# EAGLE design ATSAMD09D14 Breakout rev B (EAGLE 6.6.0)
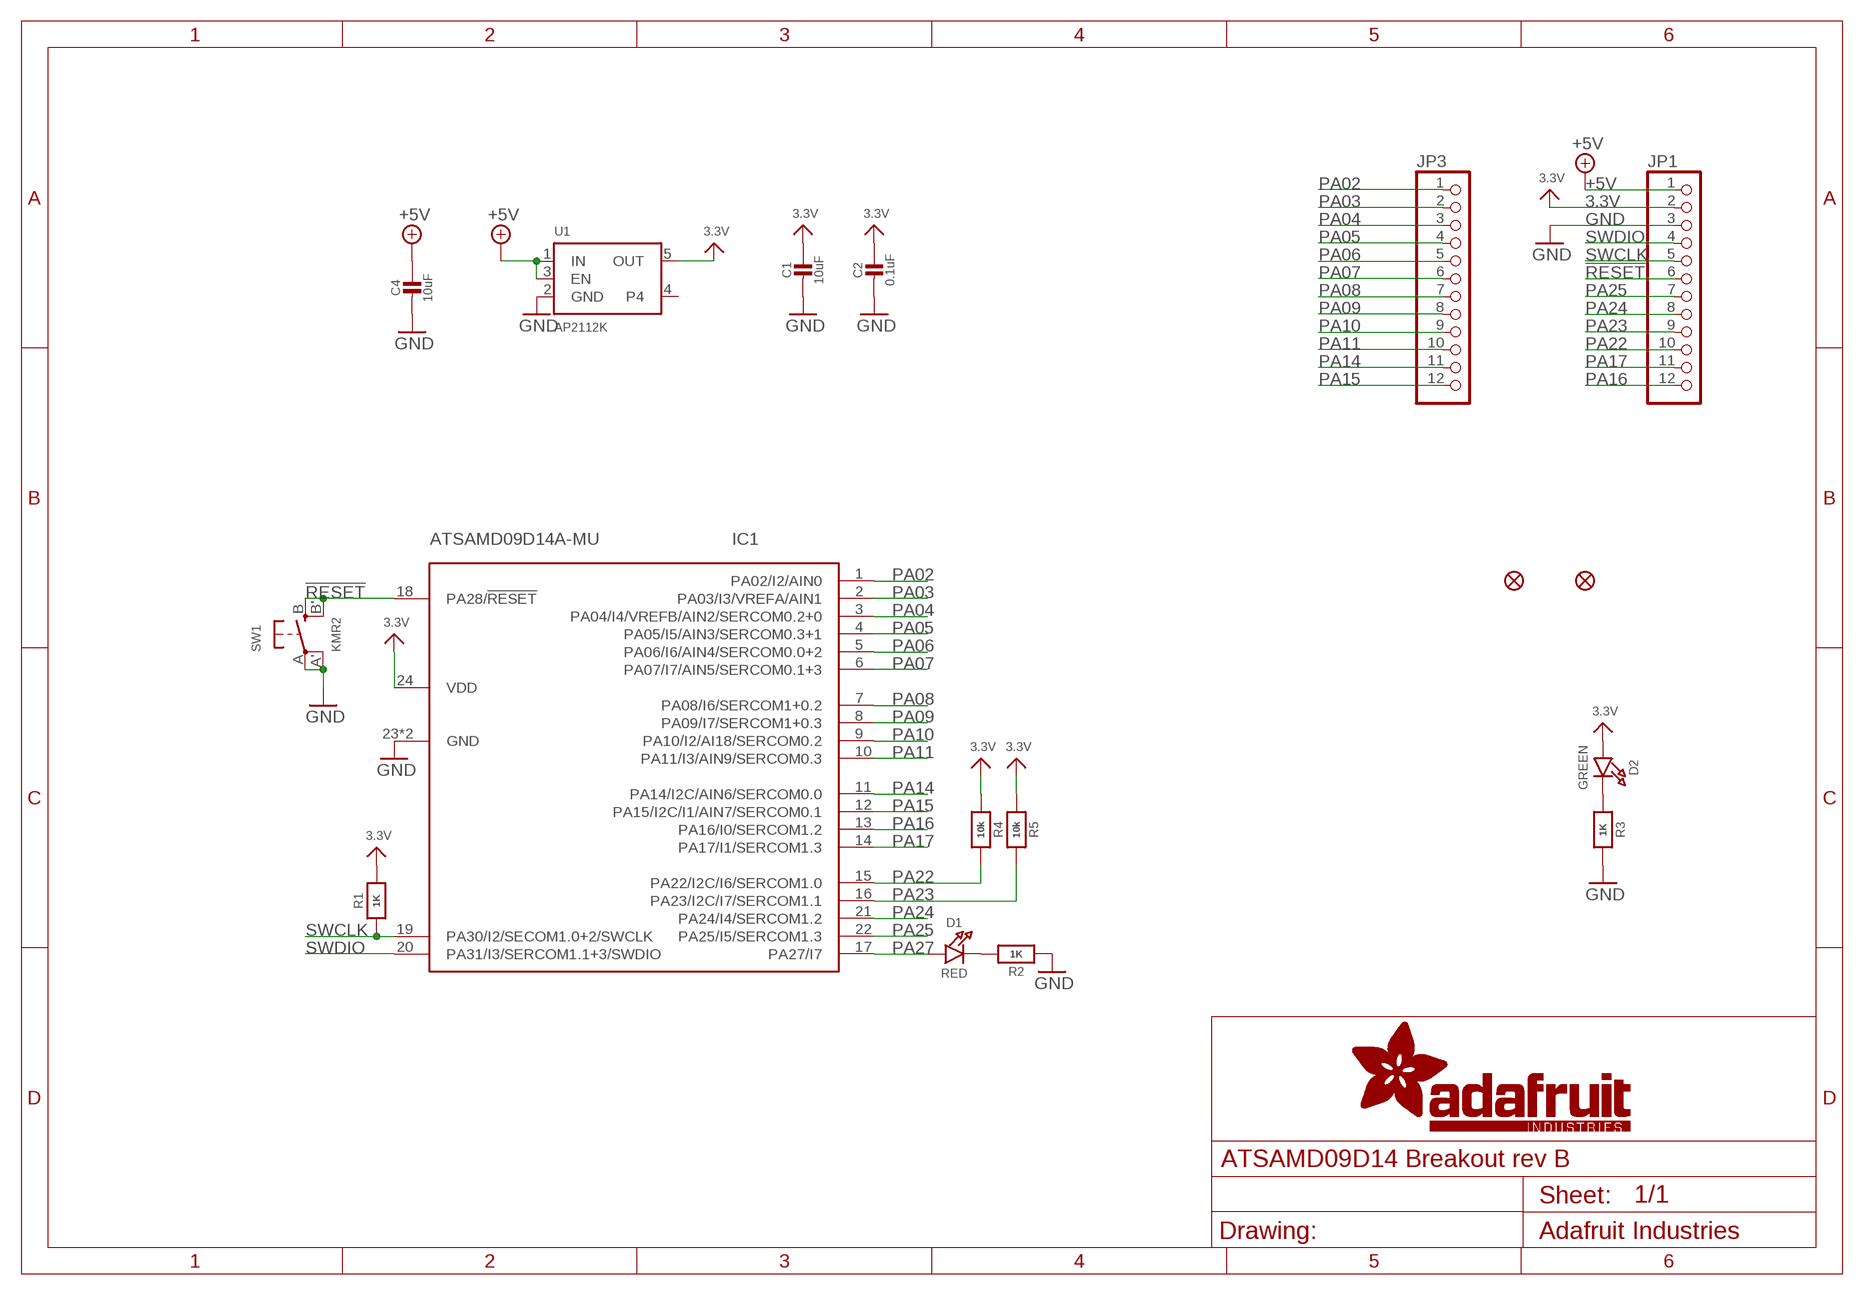
[diagram p0: schematic, sheet 1]

## Parts
C1  10uF  CAP_CERAMIC0805-NOOUTLINE  [0805-NO]
C2  0.1uF  CAP_CERAMIC0603_NO  [0603-NO]
C4  10uF  CAP_CERAMIC0805-NOOUTLINE  [0805-NO]
D1  RED  LED0805_NOOUTLINE  [CHIPLED_0805_NOOUTLINE]
D2  GREEN  LED0805_NOOUTLINE  [CHIPLED_0805_NOOUTLINE]
FID1  FIDUCIAL""  [FIDUCIAL_1MM]
FID2  FIDUCIAL""  [FIDUCIAL_1MM]
IC1  ATSAMD09D14A-MU  [QFN24_4MM]
JP1  HEADER-1X1276MIL  [1X12_ROUND_76MIL]
JP3  HEADER-1X1276MIL  [1X12_ROUND_76MIL]
R1  1K  RESISTOR_0603_NOOUT  [0603-NO]
R2  1K  RESISTOR_0603_NOOUT  [0603-NO]
R3  1K  RESISTOR_0603_NOOUT  [0603-NO]
R4  10k  RESISTOR_0603_NOOUT  [0603-NO]
R5  10k  RESISTOR_0603_NOOUT  [0603-NO]
SW1  KMR2  SWITCH_TACT_SMT4.6X2.8  [BTN_KMR2_4.6X2.8]
U1  AP2112K  VREG_SOT23-5  [SOT23-5]

## Nets
3.3V: C1.1 C2.1 D2.A IC1.24(VDD) JP1.2 R1.2 R4.1 R5.1 U1.5(OUT)
!RESET: IC1.18(PA28/!RESET) JP1.6 SW1.B'(S1) SW1.B(S)
+5V: C4.1 JP1.1 U1.1(IN) U1.3(EN)
GND: C1.2 C2.2 C4.2 IC1.23(GND) IC1.THERM(GND) JP1.3 R2.1 R3.2 SW1.A'(P1) SW1.A(P) U1.2(GND)
N$2: D1.C R2.2
N$3: D2.C R3.1
PA02: IC1.1(PA02/I2/AIN0) JP3.1
PA03: IC1.2(PA03/I3/VREFA/AIN1) JP3.2
PA04: IC1.3(PA04/I4/VREFB/AIN2/SERCOM0.2+0) JP3.3
PA05: IC1.4(PA05/I5/AIN3/SERCOM0.3+1) JP3.4
PA06: IC1.5(PA06/I6/AIN4/SERCOM0.0+2) JP3.5
PA07: IC1.6(PA07/I7/AIN5/SERCOM0.1+3) JP3.6
PA08: IC1.7(PA08/I6/SERCOM1+0.2) JP3.7
PA09: IC1.8(PA09/I7/SERCOM1+0.3) JP3.8
PA10: IC1.9(PA10/I2/AI18/SERCOM0.2) JP3.9
PA11: IC1.10(PA11/I3/AIN9/SERCOM0.3) JP3.10
PA14: IC1.11(PA14/I2C/AIN6/SERCOM0.0) JP3.11
PA15: IC1.12(PA15/I2C/I1/AIN7/SERCOM0.1) JP3.12
PA16: IC1.13(PA16/I0/SERCOM1.2) JP1.12
PA17: IC1.14(PA17/I1/SERCOM1.3) JP1.11
PA22: IC1.15(PA22/I2C/I6/SERCOM1.0) JP1.10 R4.2
PA23: IC1.16(PA23/I2C/I7/SERCOM1.1) JP1.9 R5.2
PA24: IC1.21(PA24/I4/SERCOM1.2) JP1.8
PA25: IC1.22(PA25/I5/SERCOM1.3) JP1.7
PA27: D1.A IC1.17(PA27/I7)
SWCLK: IC1.19(PA30/I2/SECOM1.0+2/SWCLK) JP1.5 R1.1
SWDIO: IC1.20(PA31/I3/SERCOM1.1+3/SWDIO) JP1.4
Unconnected: U1.4

## Library data of the parts
C1 C2 C4 = microbuilder:CAP_CERAMIC: Ceramic Capacitors For new designs, use the packages preceded by an '_' character since they are more reliable: The following footprints should be used on most boards: _0402 - Standard footprint for regular board layouts _0603 - Standard footprint for regular board layouts _0805 - Standard footprint for regular board layouts _1206 - Standard footprint for regular board layouts For extremely tight-pitch boards where space is at a premium, the following 'micro-pitch' footprints can be used (smaller pads, no silkscreen outline, etc.): _0402MP - Micro-pitch footprint for very dense/compact boards _0603MP - Micro-pitch footprint for very dense/compact boards _0805MP - Micro-pitch footprint for very dense/compact boards _1206MP - Micro-pitch footprint for very dense/compact boards
D1 D2 = microbuilder:LED: LED 0603 - 0603 Surface Mount Package 2mA: Green LED - Low Power (3.9mcd, 2ma, 1.7Vf) - Digikey: 475-2709-2-ND Orange LED - Low Power (9.8mcd, 2ma, 1.8Vf) - Digikey: 475-1194-2-ND Red LED - Low Power (5mcd, 2ma, 1.8Vf) - Digikey: 475-1195-2-ND Yellow LED - Low Power (7mcd, 2ma, 1.8Vf) - Digikey: 475-1196-2-ND 5mA: Blue LED - Low Power (17mcd, 5ma, 2.9Vf) - Digikey: LNJ937W8CRACT-ND 0805 - 0805 Surface Mount Package 2mA: Red LED (8.8mcd, 2mA, 1.8Vf, Clear) - Low Power [Digikey: 475-2510-1-ND] Green LED (5mcd, 2mA, 1.8Vf, Clear) - Low Power [Digikey: 475-2730-1-ND] Yellow LED (11.3mcd, 2mA, 1.8Vf, Clear) - Low Power [Digikey: 475-2555-1-ND] 20mA: Red LED (104mcd, 20mA, Diffused) - LS R976 [Digikey: 475-1278-6-ND] Red LED (12mcd, 20mA, 2.0Vf, Clear) - APT2012EC [Digikey: 754-1128-1-ND] Green LED (15mcd, 20mA, 2.2Vf, Clear) - APT2012GC [Digikey: 754-1131-1-ND] Orange LED (160mcd, 20mA, 2.1Vf, Clear) - APT2012SECK [Digikey: 754-1130-1-ND] 1206 - 1206 Surface Mount Package Green LED (26mcd, 20mA, Diffused) - LG N971 [Digikey: 475-1407-6-ND] Red LED (15mcd, 20mA, Diffused) - LH N974 [Digikey: 475-1416-6-ND] Cree - Cree High-Power Surface Mount LEDs XPEBWT-L1-0000-00D50 - White 111lm 350mA 2.9Vf 6200K 110° XTEAWT-00-0000-00000LEE3 - White 114lm 350mA 2.85Vf 5000K 115° Everlight - Everlight 45-21 Series Surface Mount LEDs 45-21/QK2C-B2832AC2CB2/2T - Warm White 2000mcd 20mA 3.25Vf 3050K 120° 45-21/LK2C-B38452C4CB2/2T - Nuetral White 2000mcd 20mA 3.25Vf 4150K 120° 45-21/LK2C-B50634C6CB2/2T - Cold White 2200mcd 20mA 3.25Vf 5650K 120° PLCC2 Reverse Mount LS T77K-J1L2-1-0-2-R18-Z - Red 11.25mcd 2mA 1.8Vf 630nm 120° LO T77K-L1M2-24-Z - Orange 19.6mcd 2mA 1.8Vf 606nm 120° LY T77K-K2M1-26-Z - Yellow 15.7mcd 2mA 1.8Vf 587nm 120°
FID1 FID2 = microbuilder:FIDUCIAL: Fiducial Alignment Points Various fiducial points for machine vision alignment.; BOM: EXCLUDE
IC1 = microbuilder:ATSAMD09D14A
JP1 JP3 = microbuilder:HEADER-1X12
R1-R5 = microbuilder:RESISTOR: Resistors For new designs, use the packages preceded by an '_' character since they are more reliable: The following footprints should be used on most boards: _0402 - Standard footprint for regular board layouts _0603 - Standard footprint for regular board layouts _0805 - Standard footprint for regular board layouts _1206 - Standard footprint for regular board layouts For extremely tight-pitch boards where space is at a premium, the following 'micro-pitch' footprints can be used (smaller pads, no silkscreen outline, etc.): _0402MP - Micro-pitch footprint for very dense/compact boards _0603MP - Micro-pitch footprint for very dense/compact boards _0805MP - Micro-pitch footprint for very dense/compact boards _1206MP - Micro-pitch footprint for very dense/compact boards
SW1 = microbuilder:SWITCH_TACT_SMT: SMT Tact Switches 6x6mm - Digikey: P12940SCT-ND KMR2 (4.6x2.8mm) - Digikey: 401-1426-1-ND EVQ-PQHB55 - Light Touch, 160GF (4.5x4.5mm) - Digikey: P8090SCT-ND KMT0 - KMT021 NGJ LHS (etc.) IP68/Waterproof - Digikey: CKN10289CT-ND
U1 = microbuilder:VREG_SOT23-5: SOT23-5 Fixed Voltage Regulators Part Current Out V Out V In V Dropout θJA (°C/W) TJ (°C) Digikey Part No. ADP121 150mA 3.3V 3.4-5.5V 0.09V @ 150mA -- -- ADP121-AUJZ33R7CT-ND ADP121 150mA 3.0V 3.1-5.5V 0.09V @ 150mA -- -- ADP121-AUJZ30R7CT-ND ADP122 300mA 3.3V 3.4-5.5V 0.085V @ 300mA -- -- ADP122AUJZ-3.3-R7CT-ND ADP1712 300mA 3.3V 3.5-5.5V 0.17V @ 300mA -- -- ADP1712AUJZ-3.3-R7TR-ND AP7311 (Low Cost) 150mA 3.3V 3.5-6V 0.15V @ 150mA -- -- AP7311-33WG-7DICT-ND LD39015M18R 150mA 1.8V 1.9V-5.5V 0.08V @ 100mA -- -- 497-6977-1-ND LP2985A-33DBVR 150mA 3.3V 3.3-16V 0.28V @ 150mA 206 150 296-18479-1-ND MCP1824T-3302E/OT 300mA 3.3V 3.5V-6V 0.2V @ 300mA -- -- MCP1824T-3302E/OTCT-ND MIC5205-2.5YM5 TR 150mA 2.5V 2.7-16V 0.165V @ 150mA -- -- 576-1257-2-ND MIC5205-3.0YM5 TR 150mA 3.0V 3.2V-16V 0.165V @ 150mA -- -- 576-1258-2-ND MIC5205-3.3YM5 TR 150mA 3.3V 3.5V-16V 0.165V @ 150mA -- -- 576-1259-2-ND TPS780330220 150mA 3.3V+2.2V 3.6-5.5V 250mV Max -- -- 296-23332-1-ND TDA3663/N1,135 100mA 3.3V 3.5-45V 0.18V @ 50mA -- -- 568-5343-1-ND Max operating temp can be calculated using θJA, TJ (max junction temperature), and power in watts. Set the "Maximum Ambient Temperature" until it reaches TJ ("Max Junction Temperature"), which is the absolute limit for safe use of the regulator: Heat Sink Temperature Calculator <http://www.daycounter.com/Calculators/Heat-Sink-Temperature-Calculator.phtml> For example, With 12V source into a 3.3V LP2985 and a 30mA load, we are dissipating (12V-3.3V) * 0.03A = 0.261W. With a θJA of 206 °C/W, a TJ of 150°C, and 261mW we can safely use the chip without a heat sink up to 75°C (=147.1°C Junction Temperature).

## Board
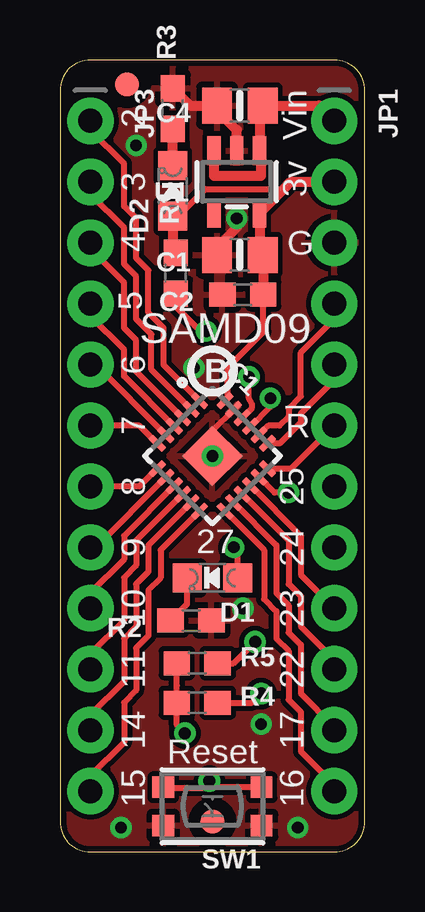
[diagram p1: board, top side]
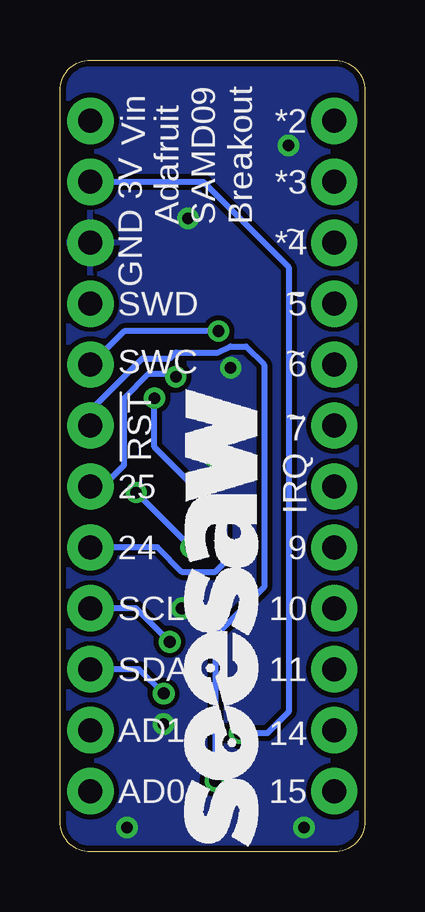
[diagram p2: board, bottom side, seen from below]

Size 12.7 x 33.02 mm. Coordinates in mm from the lower left corner, seen from the top.
Outline: 0,31.75 0,1.27 arc90 1.27,0 11.43,0 arc90 12.7,1.27 12.7,31.75 arc90 11.43,33.02 1.27,33.02 arc90 0,31.75
Copper layers (1*16): Top 0.035mm / dielectric 1.5mm / Bottom 0.035mm
Design rules "adafruit *": minimum track width 8mil, minimum drill 15.5mil, track to track 8mil, track to pad 8mil, pad to pad 8mil, via to via 8mil, smd to smd 8mil, copper to edge 10mil, drill to drill 8mil, minimum pad ring 10mil, minimum via ring 8mil, stop-mask expansion 2mil, vias tented up to drill 20mil, thermal gap 10mil

### Footprints (pad centres in the part's own frame; a part is rotated, then mirrored left to right if it is on the bottom)
0805-NO = smd 1.24 x 1.5: 1 -0.95,0; 2 0.95,0
0603-NO = smd 1.1 x 1: 1 -0.85,0; 2 0.85,0
CHIPLED_0805_NOOUTLINE = smd 1.2 x 1.2: A 0,-1.05; C 0,1.05
FIDUCIAL_1MM = smd 1 x 1: 1 0,0
QFN24_4MM = smd 0.8 x 0.28: 1 -2,1.25; 2 -2,0.75; 3 -2,0.25; 4 -2,-0.25; 5 -2,-0.75; 6 -2,-1.25; 13 2,-1.25; 14 2,-0.75; 15 2,-0.25; 16 2,0.25; 17 2,0.75; 18 2,1.25 | smd 0.28 x 0.8: 7 -1.25,-2; 8 -0.75,-2; 9 -0.25,-2; 10 0.25,-2; 11 0.75,-2; 12 1.25,-2; 19 1.25,2; 20 0.75,2; 21 0.25,2; 22 -0.25,2; 23 -0.75,2; 24 -1.25,2 | smd 1.778 x 1.778: THERM 0,0
1X12_ROUND_76MIL = drill 1 pad 1.93: 1 -13.97,0; 2 -11.43,0; 3 -8.89,0; 4 -6.35,0; 5 -3.81,0; 6 -1.27,0; 7 1.27,0; 8 3.81,0; 9 6.35,0; 10 8.89,0; 11 11.43,0; 12 13.97,0
BTN_KMR2_4.6X2.8 = smd 0.9 x 0.9: A 2.05,0.8; A' -2.05,0.8; B 2.05,-0.8; B' -2.05,-0.8
SOT23-5 = smd 0.55 x 1.2: 1 -0.95,-1.3; 2 0,-1.3; 3 0.95,-1.3; 4 0.95,1.3; 5 -0.95,1.3

### Placement (x,y rotation side)
C1  7.49,24.89 180 top
C2  7.62,23.24 180 top
C4  7.49,31.11 180 top
D1  6.35,11.43 90 top
D2  4.7,27.56 0 top
FID1  6.35,1.27 270 top
FID2  2.79,32 270 top
IC1  6.35,16.51 315 top
JP1  11.43,16.51 270 top
JP3  1.27,16.51 270 top
R1  4.83,24.13 90 top
R2  5.46,9.65 180 top
R3  4.7,30.99 90 top
R4  5.71,6.22 0 top
R5  5.71,7.87 0 top
SW1  6.35,1.91 180 top
U1  7.37,27.94 180 top
U$7  [SEESAW_LOGO]  4.45,0.25 90 bottom
U$12  [PCBFEAT-REV-040]  6.35,20.07 0 top

### Tracks (layer width: path | path; a pad name or v marks a point on that pad's centre or on a via)
3.3V  (via drill 0.5)
  Top 0.254: IC1.24 6.99,18.91 6.99,20.19 8.47,21.68 C2.1 | R4.1 R5.1 | R4.1 4.87,6.95 | 4.83,26.54 4.99,26.54 4.95,26.51 D2.A 4.92,26.51 6.05,27.64 9.32,27.64 | v5.21,4.95 4.87,5.29 R4.1
  Top 0.406: JP1.2 9.62,27.94 9.32,27.64 U1.5 8.32,24.77 | 8.32,24.77 C1.1 | D2.A 4.7,24.85 R1.2 | 8.32,24.77 8.47,24.77 C2.1
  Bottom 0.254: JP1.2 6.73,27.94 3.17,24.38 3.17,5.84 4.06,4.95 v5.21,4.95
!RESET  (via drill 0.5)
  Top 0.254: IC1.18 9.63,15.98 JP1.6 | SW1.B 4.34,2.67 5.93,2.67 v6.22,2.96 6.48,2.71 SW1.B'
  Bottom 0.254: JP1.6 11.43,18.41 9.27,20.57 8.13,20.57 7.87,20.83 6.1,20.83 5.59,21.08 4.95,21.08 4.19,20.32 4.19,11.05 6.22,9.02 v6.22,2.96
+5V
  Top 0.406: U1.3 6.42,28.19 8.38,28.19 8.38,29.24 U1.1 8.32,30.99 C4.1 10.79,31.11 JP1.1
GND  (via drill 0.48, 0.5)
  Top 0.254: IC1.23 6.35,17.57 IC1.THERM
  Top 0.406: U1.2 7.37,30.1 6.54,30.92 C4.2 5.42,31.11 R3.2 | C1.2 6.54,25.21 7.37,26.04 v7.37,26.42
  other vias: 3.17,29.46 6.35,16.51 2.54,1.02 8.38,5.33 9.91,1.02 7.62,10.16 5.59,20.19
  pour Bottom: 0,33.02 0,0 12.7,0 12.7,33.02
  pour Top: 0,33.02 0,0 12.7,0 12.7,33.02
N$2
  Top 0.254: 5.4,11.33 D1.C 5.3,10.34 R2.2
N$3
  Top 0.406: D2.C R3.1
PA02
  Top 0.254: IC1.1 4.32,20.31 4.32,21.84 3.68,22.48 3.68,24.26 3.17,24.77 3.17,26.42 2.67,26.92 2.67,28.7 1.27,30.1 JP3.1
PA03
  Top 0.254: IC1.2 3.81,20.11 3.81,21.59 3.17,22.23 3.17,24 2.67,24.51 2.67,26.04 1.27,27.43 JP3.2
PA04
  Top 0.254: IC1.3 3.17,20.04 3.17,21.34 2.67,21.84 2.67,23.75 1.27,25.15 JP3.3
PA05
  Top 0.254: IC1.4 2.67,19.84 2.67,20.95 1.27,22.35 JP3.4
PA06
  Top 0.254: IC1.5 1.48,20.32 JP3.5
PA07
  Top 0.254: IC1.6 3.31,17.78 JP3.6
PA08
  Top 0.254: IC1.7 3.31,15.24 JP3.7
PA09
  Top 0.254: IC1.8 1.48,12.7 JP3.8
PA10
  Top 0.254: IC1.9 2.67,13.18 2.67,12.19 1.27,10.79 JP3.9
PA11
  Top 0.254: IC1.10 3.17,12.98 3.17,11.94 2.67,11.43 2.67,9.65 1.27,8.26 JP3.10
PA14
  Top 0.254: IC1.11 3.68,12.78 3.68,11.68 3.17,11.18 3.17,9.4 2.67,8.89 2.67,7.11 1.27,5.71 JP3.11
PA15
  Top 0.254: IC1.12 4.19,12.58 4.19,11.43 3.68,10.92 3.68,9.02 3.17,8.51 3.17,6.73 2.67,6.22 2.67,4.57 1.27,3.17 JP3.12
PA16
  Top 0.254: IC1.13 8.51,12.58 8.51,10.54 9.02,10.03 9.02,8.89 9.53,8.38 9.53,6.35 10.03,5.84 10.03,4.19 11.43,2.79 JP1.12
PA17
  Top 0.254: IC1.14 9.02,12.78 9.02,10.79 9.53,10.29 9.53,9.14 10.03,8.64 10.03,6.6 11.43,5.21 JP1.11
PA22  (via drill 0.5)
  Top 0.254: IC1.15 9.53,12.98 9.53,11.18 10.03,10.67 10.03,9.4 11.43,8 JP1.10 | R4.2 8,6.22 v8.38,6.6
  Bottom 0.254: v8.38,6.6 9.4,7.62 JP1.10
PA23  (via drill 0.5)
  Top 0.254: IC1.16 10.03,13.18 10.03,11.56 JP1.9 | R5.2 7.24,7.87 v8.13,8.76
  Bottom 0.254: v8.13,8.76 9.53,10.16 JP1.9
PA24  (via drill 0.48)
  Top 0.254: IC1.21 8.76,18.57 v8.76,18.92
  Bottom 0.254: v8.76,18.92 8.76,16.89 5.84,13.97 5.84,12.06 6.22,11.68 7.62,11.68 8.64,12.7 JP1.8
PA25  (via drill 0.48)
  Top 0.254: IC1.22 8,18.52 8,18.67 7.87,18.92 v7.87,19.81
  Bottom 0.254: JP1.7 10.92,15.24 10.03,16.13 10.03,18.92 9.02,19.94 8,19.94 v7.87,19.81
PA27  (via drill 0.48)
  Top 0.254: v9.53,14.99 8.94,14.99 IC1.17 | D1.A 7.4,12.54 v7.24,12.7
  Bottom 0.254: v7.24,12.7 v9.53,14.99
SWCLK  (via drill 0.48)
  Top 0.254: JP1.5 11.43,19.68 10.03,18.29 10.03,17.91 9.17,17.04 IC1.19 | R1.1 4.83,22.73 5.97,21.59 v6.1,21.72
  Bottom 0.254: v6.1,21.72 10.03,21.72 JP1.5
SWDIO
  Top 0.254: JP1.4 11.43,22.23 10.03,20.83 10.03,19 9.53,18.5 9.53,18.16 9.14,17.78 8.68,17.78 IC1.20

### Text on the board
tPlace: 2 | Vin | 3 | 3v | 4 | G | 5 | SAMD09 | 6 | 7 | !R | 8 | 25 | 9 | 27 | 24 | 10 | 23 | 11 | 22 | 14 | 17 | Reset | 15 | 16
bPlace: *2 | Vin | 3V | *3 | GND | Adafruit / SAMD09 / Breakout | *4 | ~ | 5 | ~ | SWD | 6 | ~ | SWC | !RST | 7 | ~ | 25 | IRQ | 9 | 24 | 10 | SCL | 11 | SDA | 14 | AD1 | 15 | AD0